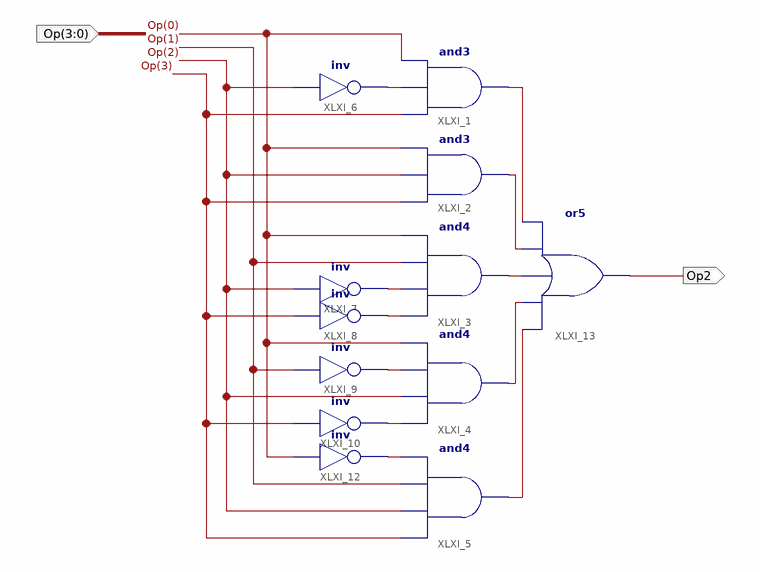
[diagram p0: schematic sheet 1]
// Xilinx ISE schematic Op2Module.sch (spartan3e) as structural Verilog: 12 symbols, 2 ports
module Op2Module (
  input  [3:0] Op,
  output Op2
);

  wire XLXN_9, XLXN_10, XLXN_11, XLXN_12, XLXN_13, XLXN_14, XLXN_31, XLXN_32, XLXN_33, XLXN_34, XLXN_35;

  and XLXI_1 (XLXN_31, Op[3], XLXN_9, Op[0]);
  and XLXI_2 (XLXN_32, Op[3], Op[2], Op[0]);
  and XLXI_3 (XLXN_33, XLXN_11, XLXN_10, Op[1], Op[0]);
  and XLXI_4 (XLXN_34, XLXN_13, Op[2], XLXN_12, Op[0]);
  and XLXI_5 (XLXN_35, Op[3], Op[2], Op[1], XLXN_14);
  not XLXI_6 (XLXN_9, Op[2]);
  not XLXI_7 (XLXN_10, Op[2]);
  not XLXI_8 (XLXN_11, Op[3]);
  not XLXI_9 (XLXN_12, Op[1]);
  not XLXI_10 (XLXN_13, Op[3]);
  not XLXI_12 (XLXN_14, Op[0]);
  or XLXI_13 (Op2, XLXN_35, XLXN_34, XLXN_33, XLXN_32, XLXN_31);
endmodule
